# Altium schematic sheet MX6ULL_DDR.SchDoc
size A4; SheetNumber: 2; SheetTotal: 5
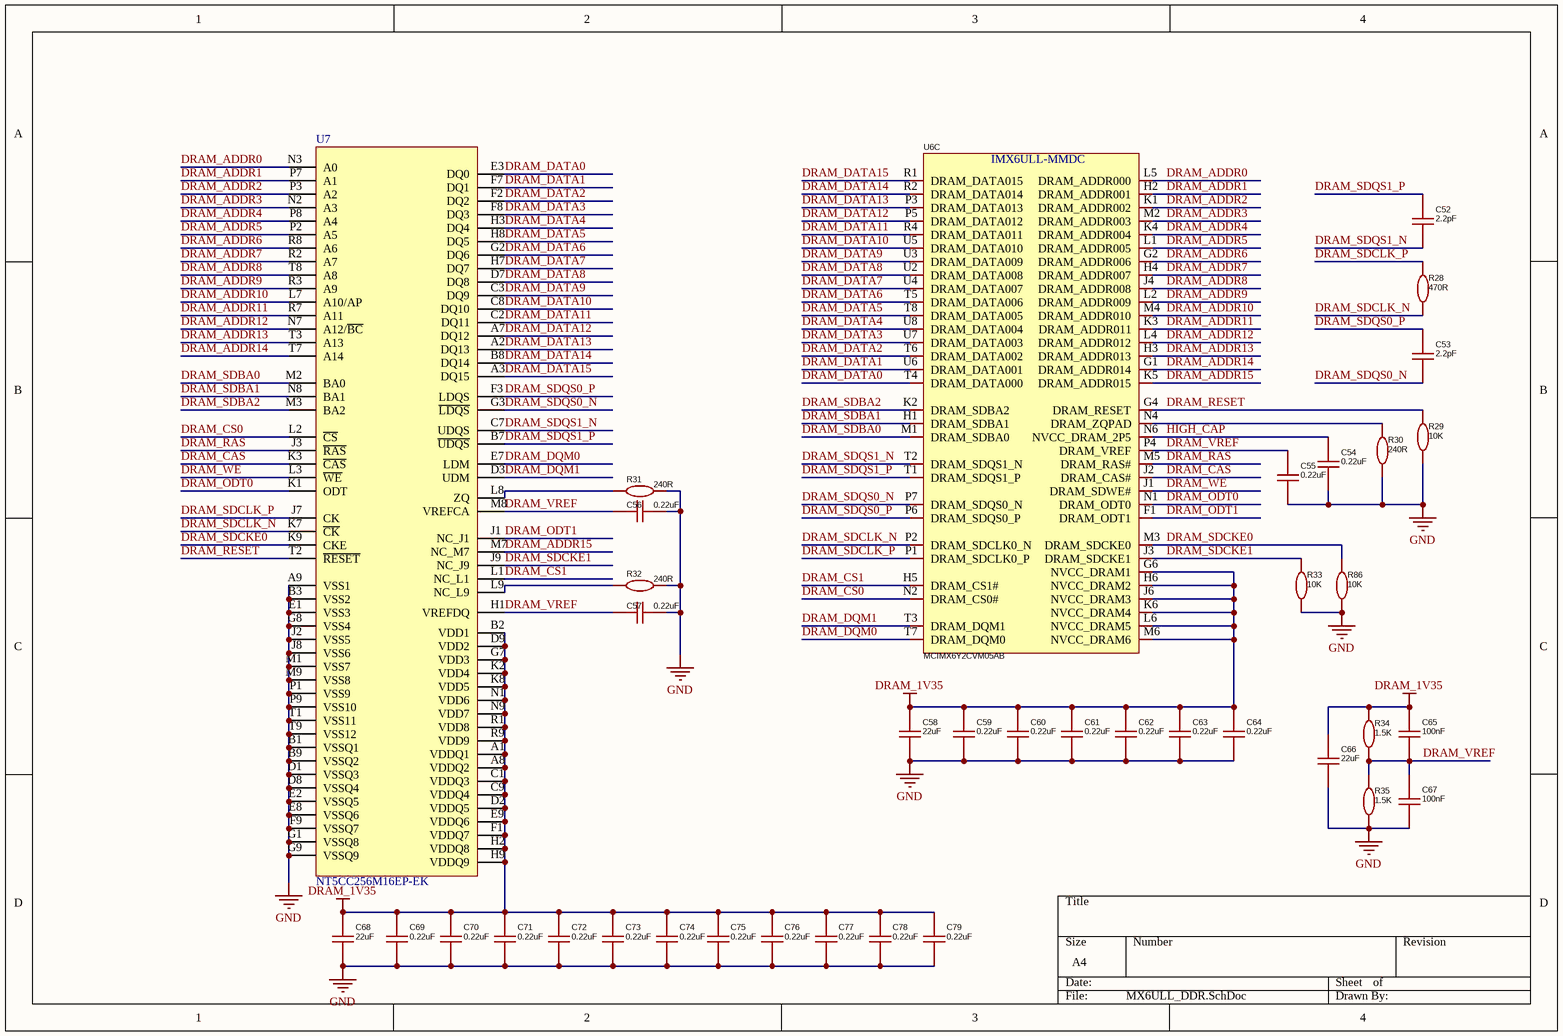
[diagram p0: MX6ULL_DDR.SchDoc]

## Parts
C52  2.2pF  [C0402]
C53  2.2pF  [C0402]
C54  0.22uF  [C0402]
C55  0.22uF  [C0402]
C56  0.22uF  [C0402]
C57  0.22uF  [C0402]
C58  22uF  [C0603]
C59  0.22uF  [C0402]
C60  0.22uF  [C0402]
C61  0.22uF  [C0402]
C62  0.22uF  [C0402]
C63  0.22uF  [C0402]
C64  0.22uF  [C0402]
C65  100nF  [C0402]
C66  22uF  [C0603]
C67  100nF  [C0402]
C68  22uF  [C0603]
C69  0.22uF  [C0402]
C70  0.22uF  [C0402]
C71  0.22uF  [C0402]
C72  0.22uF  [C0402]
C73  0.22uF  [C0402]
C74  0.22uF  [C0402]
C75  0.22uF  [C0402]
C76  0.22uF  [C0402]
C77  0.22uF  [C0402]
C78  0.22uF  [C0402]
C79  0.22uF  [C0402]
R28  470R  [R0402]
R29  10K  [R0402]
R30  240R  [R0402]
R31  240R  [R0402]
R32  240R  [R0402]
R33  10K  [R0402]
R34  1.5K  [R0402]
R35  1.5K  [R0402]
R86  10K  [R0402]
U6  MCIMX6Y2CVM05AB  [BGA-289_L14.0-W14.0-R17-C17-P0.80-BL]  (part C of 12)
U7  NT5CC256M16EP-EK  [TFBGA-96_L13.0-W8.0-R16-C6-P0.80-TL]

## Nets
DRAM_1V35: C58.2 C59.2 C60.2 C61.2 C62.2 C63.2 C64.2 C65.2 C66.2 C68.2 C69.2 C70.2 C71.2 C72.2 C73.2 C74.2 C75.2 C76.2 C77.2 C78.2 C79.2 R34.2 U6.G6(NVCC_DRAM1) U6.H6(NVCC_DRAM2) U6.J6(NVCC_DRAM3) U6.K6(NVCC_DRAM4) U6.L6(NVCC_DRAM5) U6.M6(NVCC_DRAM6) U7.A1(VDDQ1) U7.A8(VDDQ2) U7.B2(VDD1) U7.C1(VDDQ3) U7.C9(VDDQ4) U7.D2(VDDQ5) U7.D9(VDD2) U7.E9(VDDQ6) U7.F1(VDDQ7) U7.G7(VDD3) U7.H2(VDDQ8) U7.H9(VDDQ9) U7.K2(VDD4) U7.K8(VDD5) U7.N1(VDD6) U7.N9(VDD7) U7.R1(VDD8) U7.R9(VDD9)
GND: C54.1 C55.1 C56.1 C57.1 C58.1 C59.1 C60.1 C61.1 C62.1 C63.1 C64.1 C66.1 C67.1 C68.1 C69.1 C70.1 C71.1 C72.1 C73.1 C74.1 C75.1 C76.1 C77.1 C78.1 C79.1 R29.1 R30.1 R31.1 R32.1 R33.1 R35.1 R86.1 U7.A9(VSS1) U7.B1(VSSQ1) U7.B3(VSS2) U7.B9(VSSQ2) U7.D1(VSSQ3) U7.D8(VSSQ4) U7.E1(VSS3) U7.E2(VSSQ5) U7.E8(VSSQ6) U7.F9(VSSQ7) U7.G1(VSSQ8) U7.G8(VSS4) U7.G9(VSSQ9) U7.J2(VSS5) U7.J8(VSS6) U7.M1(VSS7) U7.M9(VSS8) U7.P1(VSS9) U7.P9(VSS10) U7.T1(VSS11) U7.T9(VSS12)
DRAM_ADDR0: U6.L5(DRAM_ADDR000) U7.N3(A0)
DRAM_ADDR1: U6.H2(DRAM_ADDR001) U7.P7(A1)
DRAM_ADDR2: U6.K1(DRAM_ADDR002) U7.P3(A2)
DRAM_ADDR3: U6.M2(DRAM_ADDR003) U7.N2(A3)
DRAM_ADDR4: U6.K4(DRAM_ADDR004) U7.P8(A4)
DRAM_ADDR5: U6.L1(DRAM_ADDR005) U7.P2(A5)
DRAM_ADDR6: U6.G2(DRAM_ADDR006) U7.R8(A6)
DRAM_ADDR7: U6.H4(DRAM_ADDR007) U7.R2(A7)
DRAM_ADDR8: U6.J4(DRAM_ADDR008) U7.T8(A8)
DRAM_ADDR9: U6.L2(DRAM_ADDR009) U7.R3(A9)
DRAM_ADDR10: U6.M4(DRAM_ADDR010) U7.L7(A10/AP)
DRAM_ADDR11: U6.K3(DRAM_ADDR011) U7.R7(A11)
DRAM_ADDR12: U6.L4(DRAM_ADDR012) U7.N7(A12/~{BC})
DRAM_ADDR13: U6.H3(DRAM_ADDR013) U7.T3(A13)
DRAM_ADDR14: U6.G1(DRAM_ADDR014) U7.T7(A14)
DRAM_ADDR15: U6.K5(DRAM_ADDR015) U7.M7(NC_M7)
DRAM_CAS: U6.J2(DRAM_CAS#) U7.K3(~{CAS})
DRAM_CS0: U6.N2(DRAM_CS0#) U7.L2(~{CS})
DRAM_CS1: U6.H5(DRAM_CS1#) U7.L1(NC_L1)
DRAM_DATA0: U6.T4(DRAM_DATA000) U7.E3(DQ0)
DRAM_DATA1: U6.U6(DRAM_DATA001) U7.F7(DQ1)
DRAM_DATA2: U6.T6(DRAM_DATA002) U7.F2(DQ2)
DRAM_DATA3: U6.U7(DRAM_DATA003) U7.F8(DQ3)
DRAM_DATA4: U6.U8(DRAM_DATA004) U7.H3(DQ4)
DRAM_DATA5: U6.T8(DRAM_DATA005) U7.H8(DQ5)
DRAM_DATA6: U6.T5(DRAM_DATA006) U7.G2(DQ6)
DRAM_DATA7: U6.U4(DRAM_DATA007) U7.H7(DQ7)
DRAM_DATA8: U6.U2(DRAM_DATA008) U7.D7(DQ8)
DRAM_DATA9: U6.U3(DRAM_DATA009) U7.C3(DQ9)
DRAM_DATA10: U6.U5(DRAM_DATA010) U7.C8(DQ10)
DRAM_DATA11: U6.R4(DRAM_DATA011) U7.C2(DQ11)
DRAM_DATA12: U6.P5(DRAM_DATA012) U7.A7(DQ12)
DRAM_DATA13: U6.P3(DRAM_DATA013) U7.A2(DQ13)
DRAM_DATA14: U6.R2(DRAM_DATA014) U7.B8(DQ14)
DRAM_DATA15: U6.R1(DRAM_DATA015) U7.A3(DQ15)
DRAM_DQM0: U6.T7(DRAM_DQM0) U7.E7(LDM)
DRAM_DQM1: U6.T3(DRAM_DQM1) U7.D3(UDM)
DRAM_ODT0: U6.N1(DRAM_ODT0) U7.K1(ODT)
DRAM_ODT1: U6.F1(DRAM_ODT1) U7.J1(NC_J1)
DRAM_RAS: U6.M5(DRAM_RAS#) U7.J3(~{RAS})
DRAM_RESET: R29.2 U6.G4(DRAM_RESET) U7.T2(~{RESET})
DRAM_SDBA0: U6.M1(DRAM_SDBA0) U7.M2(BA0)
DRAM_SDBA1: U6.H1(DRAM_SDBA1) U7.N8(BA1)
DRAM_SDBA2: U6.K2(DRAM_SDBA2) U7.M3(BA2)
DRAM_SDCKE0: R86.2 U6.M3(DRAM_SDCKE0) U7.K9(CKE)
DRAM_SDCKE1: R33.2 U6.J3(DRAM_SDCKE1) U7.J9(NC_J9)
DRAM_SDCLK_N: R28.1 U6.P2(DRAM_SDCLK0_N) U7.K7(~{CK})
DRAM_SDCLK_P: R28.2 U6.P1(DRAM_SDCLK0_P) U7.J7(CK)
DRAM_SDQS0_N: C53.1 U6.P7(DRAM_SDQS0_N) U7.G3(~{LDQS})
DRAM_SDQS0_P: C53.2 U6.P6(DRAM_SDQS0_P) U7.F3(LDQS)
DRAM_SDQS1_N: C52.1 U6.T2(DRAM_SDQS1_N) U7.C7(UDQS)
DRAM_SDQS1_P: C52.2 U6.T1(DRAM_SDQS1_P) U7.B7(~{UDQS})
DRAM_VREF: C55.2 C56.2 C57.2 C65.1 C67.2 R34.1 R35.2 U6.P4(DRAM_VREF) U7.H1(VREFDQ) U7.M8(VREFCA)
DRAM_WE: U6.J1(DRAM_SDWE#) U7.L3(~{WE})
HIGH_CAP: C54.2 U6.N6(NVCC_DRAM_2P5)
NetR30_2: R30.2 U6.N4(DRAM_ZQPAD)
NetR31_2: R31.2 U7.L8(ZQ)
NetR32_2: R32.2 U7.L9(NC_L9)

## Notes on the sheet
- (in symbol MCIMX6Y2CVM05AB, part C) IMX6ULL-MMDC

## Library data of the parts
C52-C57 C59-C64 C69-C79 = C0402: 容值:100nF;精度:±10%;额定电压:50V;材质(温度系数):X7R;; Manufacturer: muRata(村田); Symbol: GRM155R71H104KE14D; Add into BOM: yes; Value: 100nF; Tolerance: ±10%; Voltage Rated: 50V; Temperature Coefficient: X7R; Device: GRM155R71H104KE14D; LCSC Part Name: 100nF ±10% 50V; Supplier Part: C77020; Manufacturer Part: GRM155R71H104KE14D; Supplier Footprint: 0402; JLCPCB Part Class: 扩展库; Datasheet: https://atta.szlcsc.com/upload/public/pdf/source/20180326/C77020_39BD49C951FF1AF0DB1F1FAC5AC1E401.pdf; Supplier: LCSC; Convert to PCB: yes
C58 C66 C68 = C0603: 容值:22uF;精度:±20%;额定电压:10V;材质(温度系数):X5R;; Manufacturer: Chinocera(华瓷); Symbol: HGC0603R5226M100NTHJ; Add into BOM: yes; Tolerance: ±20%; Voltage Rated: 10V; Temperature Coefficient: X5R; Device: HGC0603R5226M100NTHJ; LCSC Part Name: 22uF ±20% 10V; Supplier Part: C7432770; Manufacturer Part: HGC0603R5226M100NTHJ; Supplier Footprint: 0603; JLCPCB Part Class: 扩展库; Datasheet: https://atta.szlcsc.com/upload/public/pdf/source/20240320/FAC3FEC40A78BC5CCCE96C232A94D860.pdf; Supplier: LCSC; Convert to PCB: yes; Value: 22uF
C65 C67 = C0402: 容值:100nF;精度:±10%;额定电压:50V;材质(温度系数):X7R;; Manufacturer: muRata(村田); Symbol: GRM155R71H104KE14D; Add into BOM: yes; Tolerance: ±10%; Voltage Rated: 50V; Temperature Coefficient: X7R; Device: GRM155R71H104KE14D; LCSC Part Name: 100nF ±10% 50V; Supplier Part: C77020; Manufacturer Part: GRM155R71H104KE14D; Supplier Footprint: 0402; JLCPCB Part Class: 扩展库; Datasheet: https://atta.szlcsc.com/upload/public/pdf/source/20180326/C77020_39BD49C951FF1AF0DB1F1FAC5AC1E401.pdf; Supplier: LCSC; Convert to PCB: yes; Value: 100nF
R28-R35 R86 = R0402: 电阻类型:厚膜电阻;阻值:1kΩ;精度:±1%;功率:62.5mW;最大工作电压:50V;温度系数:±100ppm/℃;; Manufacturer: UNI-ROYAL(厚声); Symbol: 0402WGF1001TCE; Add into BOM: yes; Value: 1kΩ; Tolerance: ±1%; Power(Watts): 62.5mW; Overload Voltage (Max): 50V; Device: 0402WGF1001TCE; LCSC Part Name: 1kΩ ±1% 62.5mW 厚膜电阻; Supplier Part: C11702; Manufacturer Part: 0402WGF1001TCE; Supplier Footprint: 0402; JLCPCB Part Class: 基础库; Datasheet: https://atta.szlcsc.com/upload/public/pdf/source/20200306/C422600_1E6D84923E4A46A82E41ADD87F860B5C.pdf; Supplier: LCSC; Convert to PCB: yes; Type: 厚膜电阻; Temperature Coefficient: ±100ppm/℃; Operating Temperature Range: -55℃~+155℃
U6 = MCIMX6Y2CVM05AB: CPU内核:ARM-A系列;RAM总容量:128KB;GPIO端口数量:-;工作电压范围:-;CPU最大主频:528MHz;程序存储器类型:-;应用领域:-;; Manufacturer: NXP(恩智浦); Add into BOM: yes; RAM Size: 128KB; CPU Maximum Speed: 528MHz; ADC (Bit): 12bit; UART/USART: 8; I2C: 4; Universal Serial Bus: 有; Peripheral/Function: 真随机数发生器; Symbol: MCIMX6Y2CVM05AB; Device: MCIMX6Y2CVM05AB; LCSC Part Name: MCIMX6Y2CVM05AB; Supplier Part: C394783; Manufacturer Part: MCIMX6Y2CVM05AB; Supplier Footprint: MAPBGA-289(14x14); JLCPCB Part Class: 扩展库; Datasheet: https://atta.szlcsc.com/upload/public/pdf/source/20190903/C414057_F91A491E37DFDD32A6FE61E7D0CA74B1.pdf; Supplier: LCSC; Convert to PCB: yes; CPU Core: ARM-A系列; GPIO Ports Number: -; Operating Voltage Range: -; Program Memory Type: -; Operating Temperature Range: -40℃~+105℃; DAC (Bit): -; PWM (Bit): -; 8Bit Timer: -; 16Bit Timer: -; 32Bit Timer: -; CAN: -; I2S: -; SPI: 4; Internal Comparator: -; communication protocol: -; Watchdog: -; Real-Time Clock: -; Infrared Data Association: -; Low-Voltage Detect: -; CCP Capture/Compare: -; LCD Module: 有; LED Module: -; Secure Digital Input and Output: -; Direct Memory Access: -; Internal Oscillator: -; Application Area: -
U7 = MT41K256M16TW